# EAGLE design uno-pneumatic-shield I2C (EAGLE 7.6.0)
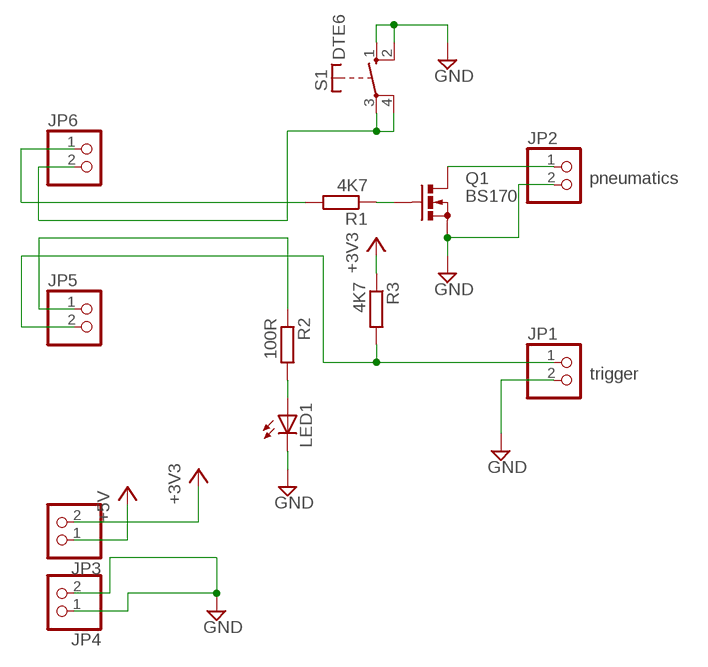
[diagram p0: schematic, sheet 1]

## Parts
JP1  PINHD-1X2  [1X02]
JP2  PINHD-1X2  [1X02]
JP3  PINHD-1X2  [1X02]
JP4  PINHD-1X2  [1X02]
JP5  PINHD-1X2  [1X02]
JP6  PINHD-1X2  [1X02]
LED1  LED3MM  [LED3MM]
Q1  BS170  [SOT54E]
R1  4K7  R-EU_0204/7  [0204/7]
R2  100R  R-EU_0204/7  [0204/7]
R3  4K7  R-EU_0204/7  [0204/7]
S1  DTE6  [DTE6]

## Nets
+3V3: JP3.2 R3.1
+5V: JP3.1
GND: JP1.2 JP2.2 JP4.1 JP4.2 LED1.K(C) Q1.S S1.1(S) S1.2(S)
N$1: JP6.1 R1.2
N$2: Q1.G R1.1
N$3: LED1.A R2.2
N$4: JP2.1 Q1.D
N$5: JP6.2 S1.3(P) S1.4(P)
N$6: JP1.1 JP5.2 R3.2
N$7: JP5.1 R2.1

## Notes on the sheet
- pneumatics
- trigger

## Library data of the parts
JP1-JP6 = opto:PINHD-1X2: PIN HEADER
LED1 = opto:LED: LED OSRAM: - CHIPLED LG R971, LG N971, LY N971, LG Q971, LY Q971, LO R971, LY R971 LH N974, LH R974 LS Q976, LO Q976, LY Q976 LO Q996 - Hyper CHIPLED LW Q18S LB Q993, LB Q99A, LB R99A - SideLED LS A670, LO A670, LY A670, LG A670, LP A670 LB A673, LV A673, LT A673, LW A673 LH A674 LY A675 LS A676, LA A676, LO A676, LY A676, LW A676 LS A679, LY A679, LG A679 - Hyper Micro SIDELED® LS Y876, LA Y876, LO Y876, LY Y876 LT Y87S - SmartLED LW L88C, LW L88S LB L89C, LB L89S, LG L890 LS L89K, LO L89K, LY L89K LS L896, LA L896, LO L896, LY L896 - TOPLED LS T670, LO T670, LY T670, LG T670, LP T670 LSG T670, LSP T670, LSY T670, LOP T670, LYG T670 LG T671, LOG T671, LSG T671 LB T673, LV T673, LT T673, LW T673 LH T674 LS T676, LA T676, LO T676, LY T676, LB T676, LH T676, LSB T676, LW T676 LB T67C, LV T67C, LT T67C, LS T67K, LO T67K, LY T67K, LW E67C LS E67B, LA E67B, LO E67B, LY E67B, LB E67C, LV E67C, LT E67C LW T67C LS T679, LY T679, LG T679 LS T770, LO T770, LY T770, LG T770, LP T770 LB T773, LV T773, LT T773, LW T773 LH T774 LS E675, LA E675, LY E675, LS T675 LS T776, LA T776, LO T776, LY T776, LB T776 LHGB T686 LT T68C, LB T68C - Hyper Mini TOPLED® LB M676 - Mini TOPLED Santana® LG M470 LS M47K, LO M47K, LY M47K Source: http://www.osram.convergy.de LUXEON: - LUMILED® LXK2-PW12-R00, LXK2-PW12-S00, LXK2-PW14-U00, LXK2-PW14-V00 LXK2-PM12-R00, LXK2-PM12-S00, LXK2-PM14-U00 LXK2-PE12-Q00, LXK2-PE12-R00, LXK2-PE12-S00, LXK2-PE14-T00, LXK2-PE14-U00 LXK2-PB12-K00, LXK2-PB12-L00, LXK2-PB12-M00, LXK2-PB14-N00, LXK2-PB14-P00, LXK2-PB14-Q00 LXK2-PR12-L00, LXK2-PR12-M00, LXK2-PR14-Q00, LXK2-PR14-R00 LXK2-PD12-Q00, LXK2-PD12-R00, LXK2-PD12-S00 LXK2-PH12-R00, LXK2-PH12-S00 LXK2-PL12-P00, LXK2-PL12-Q00, LXK2-PL12-R00 Source: www.luxeon.com KINGBRIGHT: KA-3528ASYC Source: www.kingbright.com
Q1 = opto:BS170: N-CHANNEL MOS FET
R1-R3 = opto:R-EU_: RESISTOR, European symbol
S1 = opto:DT: ITT SWITCH

## Board
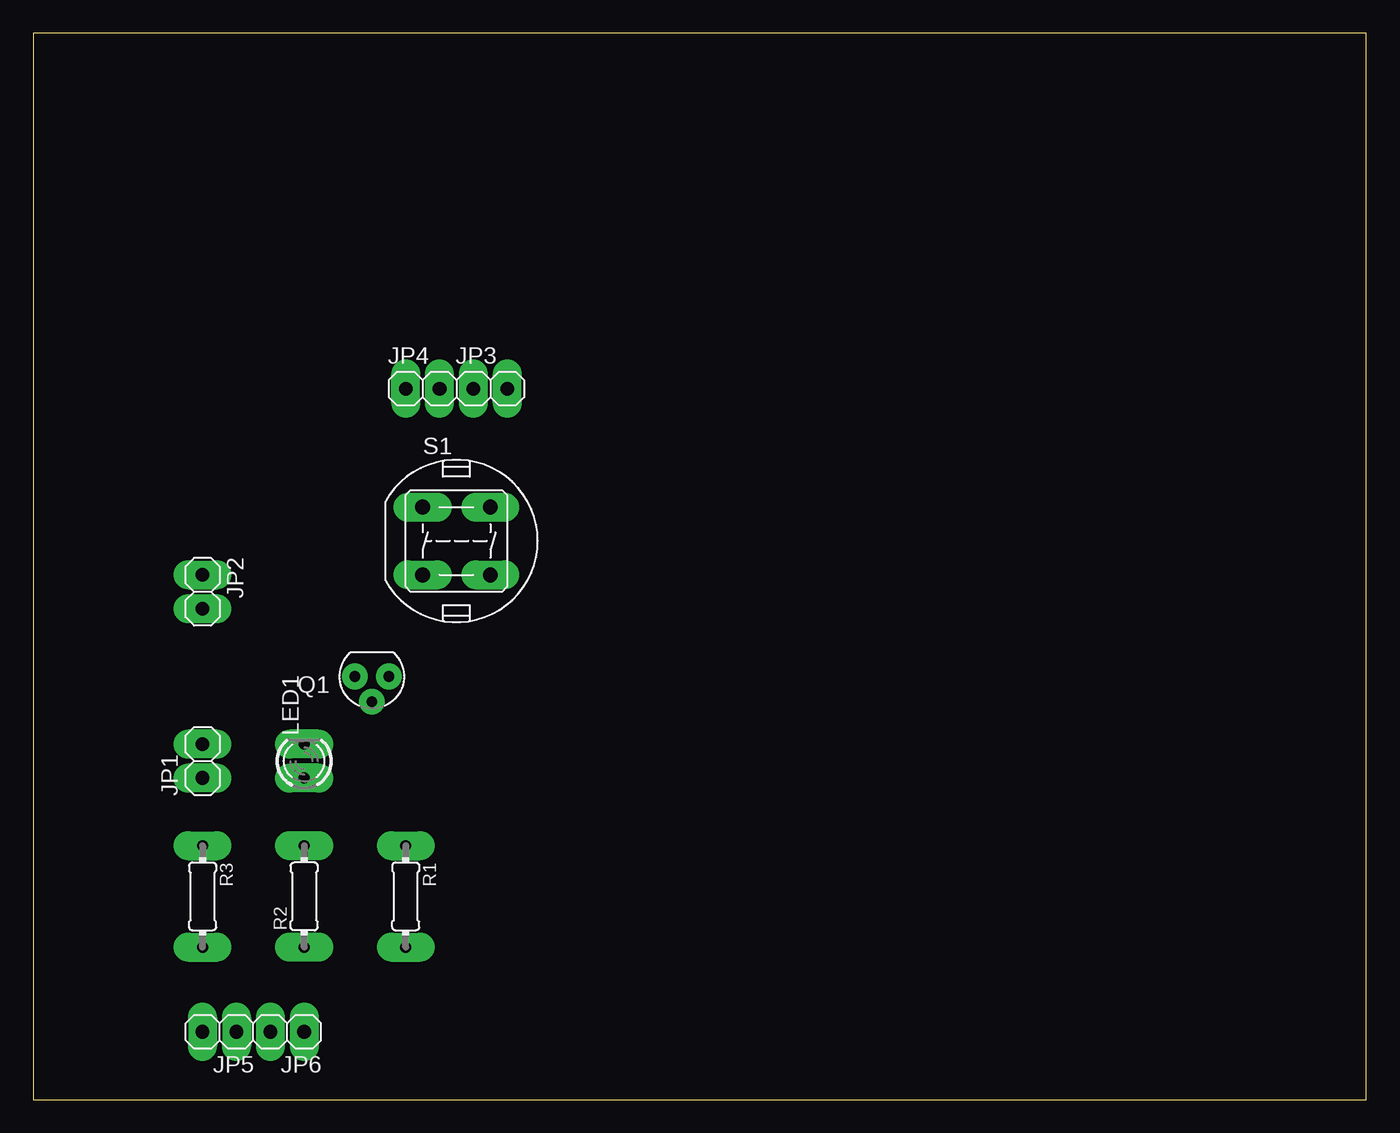
[diagram p1: board, top side]
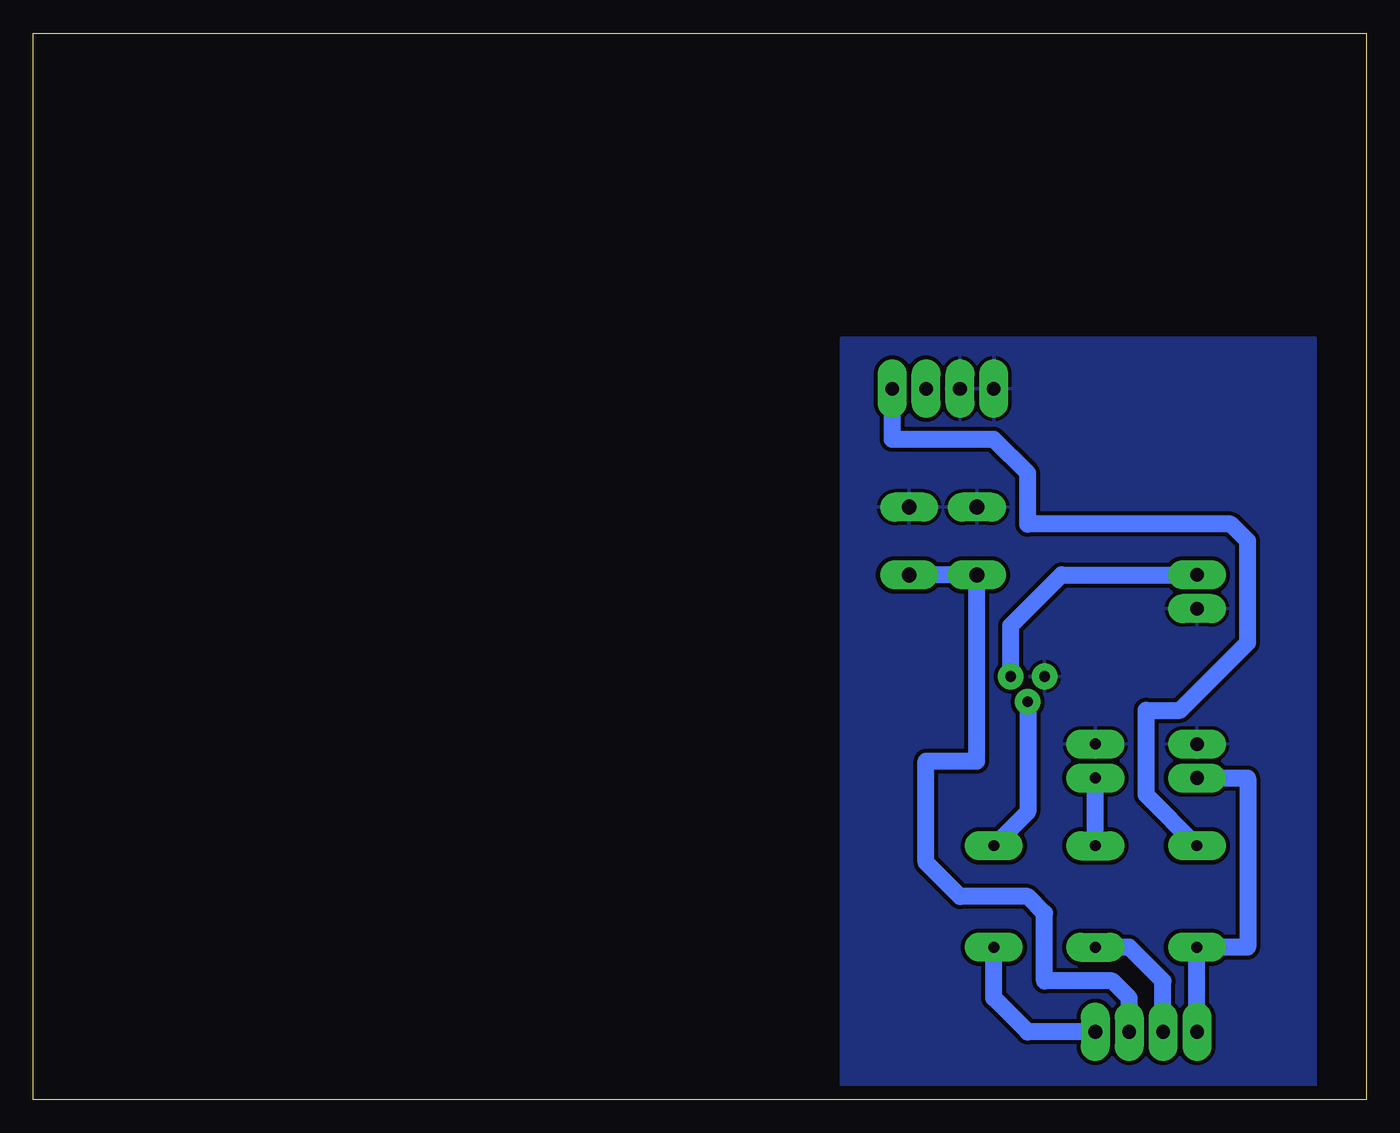
[diagram p2: board, bottom side, seen from below]

Size 100 x 80 mm. Coordinates in mm from the lower left corner, seen from the top.
Outline: 0,0 100,0 100,80 0,80 0,0
Copper layers (1*16): Top 0.035mm / dielectric 1.5mm / Bottom 0.035mm
Design rules "default *": minimum track width 10mil, minimum drill 24mil, track to track 12mil, track to pad 12mil, pad to pad 12mil, via to via 12mil, smd to smd 12mil, copper to edge 40mil, drill to drill 12mil, minimum pad ring 10mil, minimum via ring 8mil, stop-mask expansion 4mil, vias tented up to drill 0mil, thermal gap 10mil

### Footprints (pad centres in the part's own frame; a part is rotated, then mirrored left to right if it is on the bottom)
1X02 = drill 1.016 pad 2.184 long: 1 -1.27,0; 2 1.27,0
LED3MM = drill 0.813 pad 2.184 long: A -1.27,0; K 1.27,0
SOT54E = drill 0.813 pad 1.93: D -1.27,0; G 0,1.905; S 1.27,0
0204/7 = drill 0.813 pad 2.184 long: 1 -3.81,0; 2 3.81,0
DTE6 = drill 1.118 pad 2.184 long: 1 -2.54,2.54; 2 2.54,2.54; 3 2.54,-2.54; 4 -2.54,-2.54

### Placement (x,y rotation side)
JP1  12.7,25.4 90 top
JP2  12.7,38.1 270 top
JP3  34.29,53.34 0 top
JP4  29.21,53.34 0 top
JP5  13.97,5.08 180 top
JP6  19.05,5.08 180 top
LED1  20.32,25.4 90 top
Q1  25.4,31.75 180 top
R1  27.94,15.24 270 top
R2  20.32,15.24 90 top
R3  12.7,15.24 270 top
S1  31.75,41.91 0 top

### Tracks (layer width: path | path; a pad name or v marks a point on that pad's centre or on a via)
+3V3
  Bottom 1.27: R3.1 16.51,22.86 16.51,29.21 13.97,29.21 8.89,34.29 8.89,41.91 10.16,43.18 25.4,43.18 25.4,46.99 27.94,49.53 35.56,49.53 JP3.2
GND
  pour Bottom: 5.08,57.15 39.37,57.15 39.37,0 3.81,0 3.81,1.27 3.81,57.15
N$1
  Bottom 1.27: JP6.1 25.4,5.08 27.94,7.62 R1.2
N$2
  Bottom 1.27: Q1.G 25.4,21.59 R1.1
N$3
  Bottom 1.27: R2.2 LED1.A
N$4
  Bottom 1.27: Q1.D 26.67,35.56 22.86,39.37 JP2.1
N$5
  Bottom 1.27: JP6.2 17.78,7.62 19.05,8.89 24.13,8.89 24.13,13.97 25.4,15.24 30.48,15.24 33.02,17.78 33.02,25.4 29.21,25.4 S1.4 S1.3
N$6
  Bottom 1.27: JP5.2 R3.2 8.89,11.43 8.89,24.13 JP1.1
N$7
  Bottom 1.27: JP5.1 15.24,8.89 17.78,11.43 R2.1